# EAGLE design optoinout_breakout (EAGLE 9.4.0)
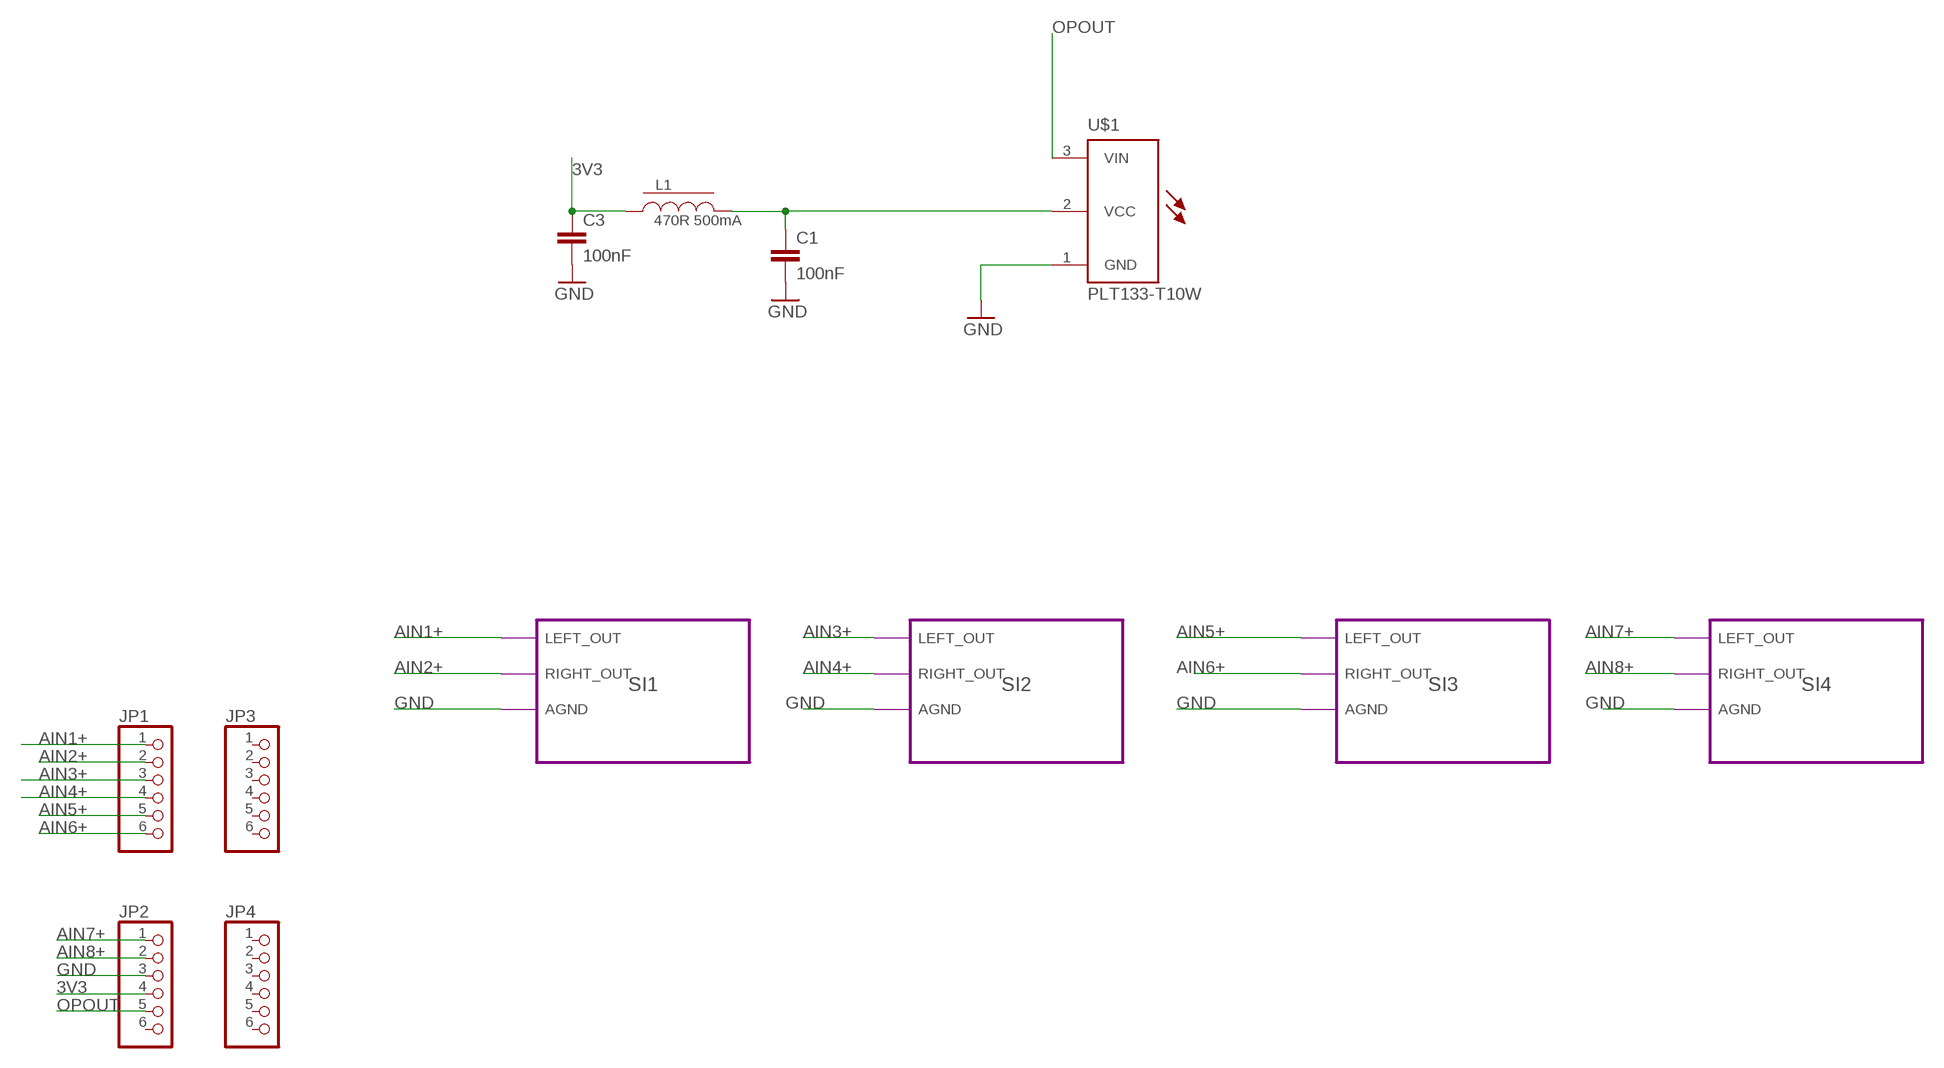
[diagram p0: schematic, sheet 1]

## Parts
C1  100nF  C-EUC1206  [C1206]
C3  100nF  C-EUC1206  [C1206]
JP1  PINHD-1X6  [1X06]
JP2  PINHD-1X6  [1X06]
JP3  PINHD-1X6  [1X06]
JP4  PINHD-1X6  [1X06]
L1  470R 500mA  EXC3BPL0805  [L0805]
U$1  PLT133-T10W  [PLR135-T10_PLT133-T10W]

## Module instances
SI1 = STIN
SI2 = STIN
SI3 = STIN
SI4 = STIN

## Nets
3V3: C3.1 JP2.4 L1.P$1
AIN1+: JP1.1 ; port SI1.LEFT_OUT
AIN2+: JP1.2 ; port SI1.RIGHT_OUT
AIN3+: JP1.3 ; port SI2.LEFT_OUT
AIN4+: JP1.4 ; port SI2.RIGHT_OUT
AIN5+: JP1.5 ; port SI3.LEFT_OUT
AIN6+: JP1.6 ; port SI3.RIGHT_OUT
AIN7+: JP2.1 ; port SI4.LEFT_OUT
AIN8+: JP2.2 ; port SI4.RIGHT_OUT
GND: C1.2 C3.2 JP2.3 U$1.1(GND) ; port SI1.AGND SI2.AGND SI3.AGND SI4.AGND
N$3: C1.1 L1.P$2 U$1.2(VCC)
OPOUT: JP2.5 U$1.3(VIN)
Unconnected: JP2.6 JP3.1 JP3.2 JP3.3 JP3.4 JP3.5 JP3.6 JP4.1 JP4.2 JP4.3 JP4.4 JP4.5 JP4.6

## Library data of the parts
C1 C3 = resistor:C-EU: CAPACITOR, European symbol
JP1-JP4 = pinhead:PINHD-1X6: PIN HEADER
L1 = ferrite:EXC3BP: Chip Bead Core
U$1 = PLT133-T10W:PLT133-T10W: Photo-link Light Transmitter Unit; AVAILABILITY: Unavailable; DESCRIPTION: PLT133 Series 2.7 - 5.5 V 16 Mbps 5.5 mA 680 nm Photo-Link Light Transmitter; MF: Everlight Electronics; MP: PLT133/T10W; PACKAGE: DIP-5 Everlight; PRICE: None

## Module STIN
Ports: LEFT_OUT(io) RIGHT_OUT(io) AGND(io)
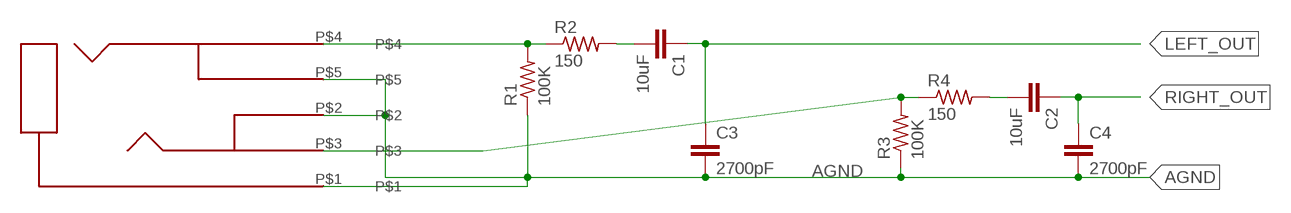
[diagram p1: schematic, module STIN, sheet 1]

### Parts
C1  10uF  C-EUC1206  [C1206]
C2  10uF  C-EUC1206  [C1206]
C3  2700pF  C-EUC1206  [C1206]
C4  2700pF  C-EUC1206  [C1206]
R1  100K  R-US_R1206  [R1206]
R2  150  R-US_R1206  [R1206]
R3  100K  R-US_R1206  [R1206]
R4  150  R-US_R1206  [R1206]
U$3  ACJS-MV-5  [ACJS-MV5]

### Nets
AGND: C3.2 C4.2 R1.1 R3.1 U$3.P$1 U$3.P$2 U$3.P$5
LEFT_OUT [defaultyyyy]: C1.1 C3.1
N$1 [defaultyyyy]: R1.2 R2.1 U$3.P$4
N$7 [defaultyyyy]: C1.2 R2.2
N$10 [defaultyyyy]: R3.2 R4.1 U$3.P$3
N$11 [defaultyyyy]: C2.2 R4.2
RIGHT_OUT [defaultyyyy]: C2.1 C4.1

### Library data of the parts
C1-C4 = resistor-nick:C-EU: CAPACITOR, European symbol
R1-R4 = resistor-nick:R-US_: RESISTOR, American symbol
U$3 = acjs-mv:ACJS-MV-5

## Net classes
0 default: width 0.356 mm
1 defaultyyyy: width 0.356 mm

## Board
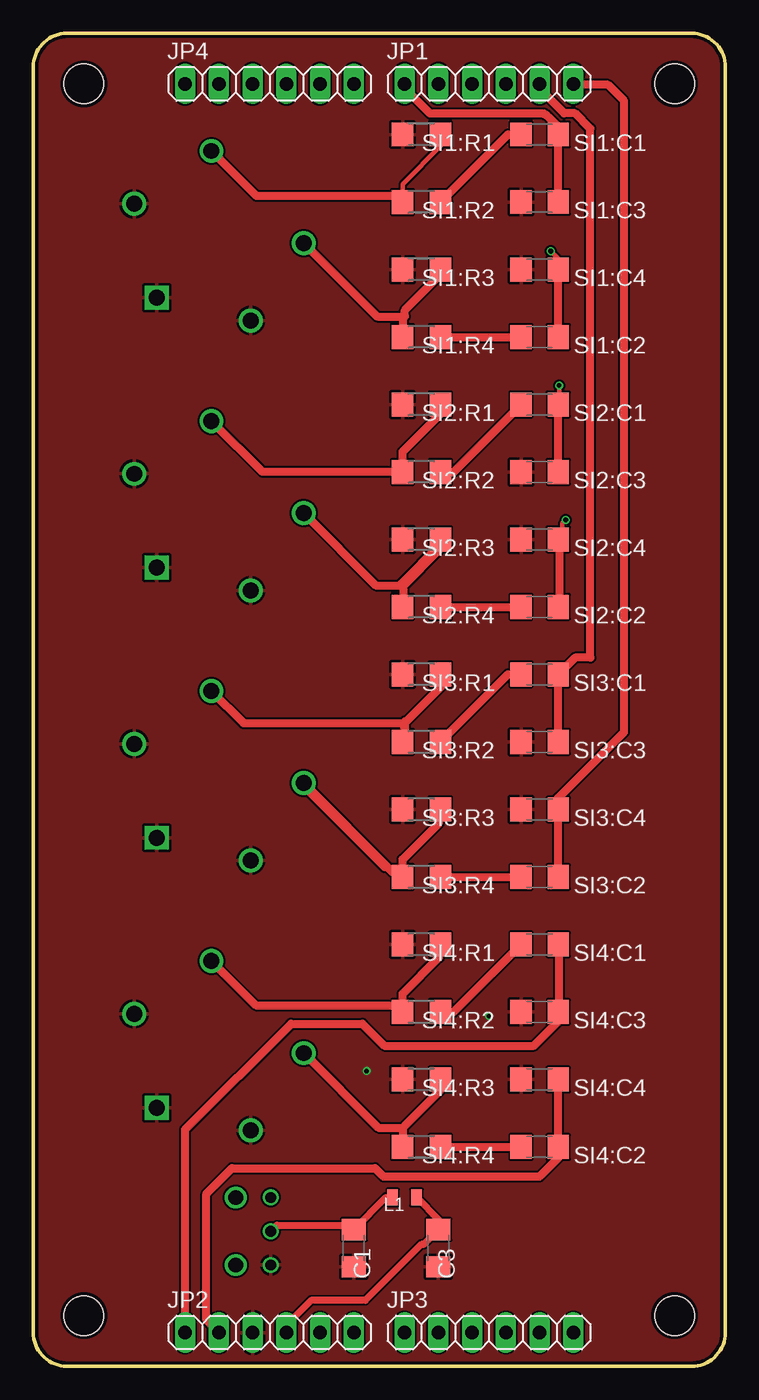
[diagram p2: board, top side]
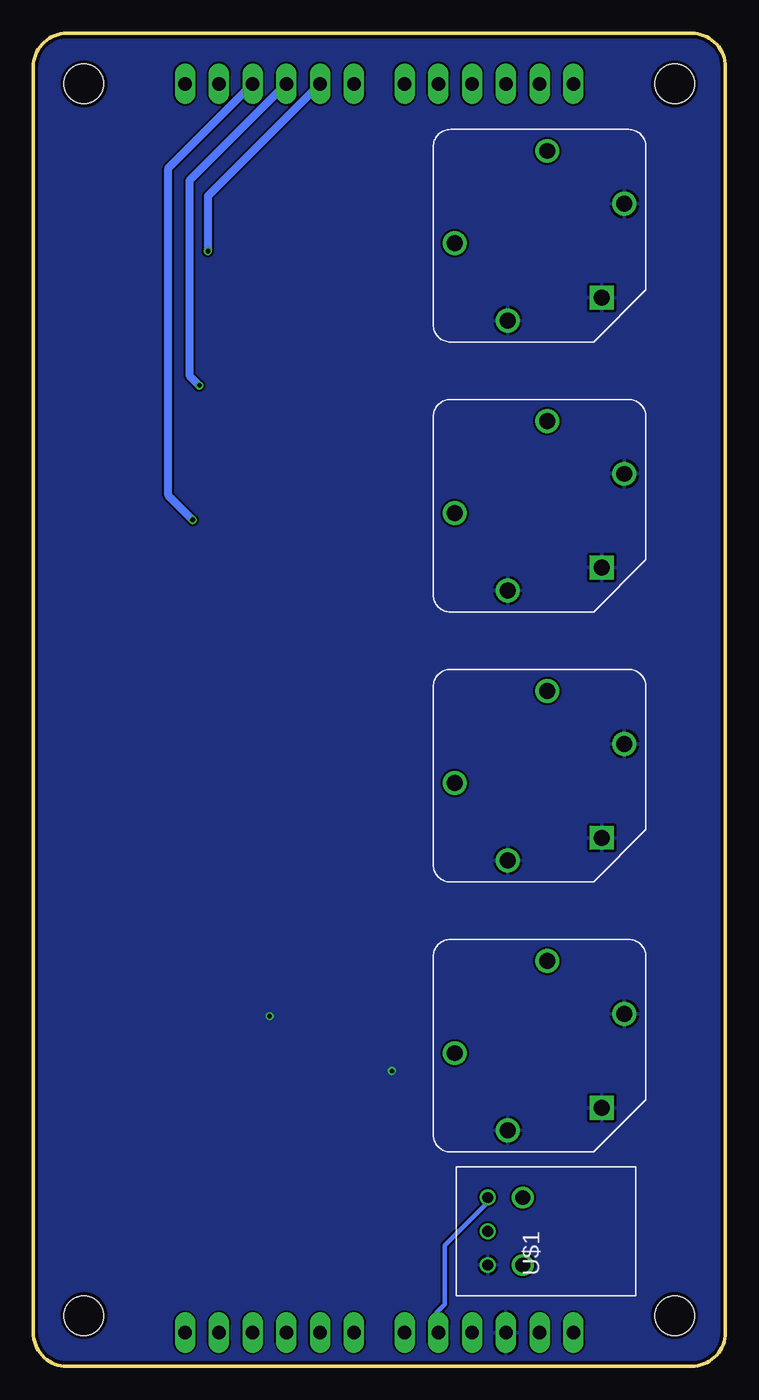
[diagram p3: board, bottom side, seen from below]

Size 52.07 x 100.33 mm. Coordinates in mm from the lower left corner, seen from the top.
Outline: 0,97.79 0,2.54 arc90 2.54,0 49.53,0 arc90 52.07,2.52 52.07,97.79 arc90 49.53,100.33 2.54,100.33 arc90 0,97.79
Copper layers (1*16): Top 0.018mm / dielectric 1.55mm / Bottom 0.018mm
Design rules "eC_2Layer_PClass6_BaseCopperO18_eCDefault": minimum track width 0.15mm, minimum drill 0.35mm, track to track 0.15mm, track to pad 0.15mm, pad to pad 0.15mm, via to via 0.15mm, smd to smd 0mil, copper to edge 0.25mm, drill to drill 0.35mm, minimum pad ring 0.175mm, minimum via ring 0.125mm, stop-mask expansion 0mil, vias tented up to drill 0.45mm, thermal gap 0.2mm
Holes 3 mm at 3.81,96.52 48.26,96.52 3.81,3.81 48.26,3.81

### Footprints (pad centres in the part's own frame; a part is rotated, then mirrored left to right if it is on the bottom)
C1206 = smd 1.6 x 1.8: 1 -1.4,0; 2 1.4,0
1X06 = drill 1.016 long: 1 -6.35,0; 2 -3.81,0; 3 -1.27,0; 4 1.27,0; 5 3.81,0; 6 6.35,0
L0805 = smd 0.8 x 1.2: P$1 -0.9,0; P$2 0.9,0
R1206 = smd 1.6 x 1.803: 1 -1.422,0; 2 1.422,0
ACJS-MV5 = drill 1.2 square: P$1 4.67,-4.67 | drill 1.2: P$2 -2.4,-6.38; P$3 -6.38,-0.56; P$4 0.56,6.38; P$5 6.38,2.4
PLR135-T10_PLT133-T10W = drill 0.8: 1 2.54,-2.63; 2 0,-2.63; 3 -2.54,-2.63 | drill 1.1: NC1 2.54,0; NC2 -2.54,0

### Placement (x,y rotation side)
C1  24.13,8.89 270 top
C3  30.48,8.89 270 top
JP1  34.29,96.52 0 top
JP2  17.78,2.54 0 top
JP3  34.29,2.54 0 top
JP4  17.78,96.52 0 top
L1  27.94,12.7 180 top
SI1:C1  10uF  [C1206]  38.1,92.71 180 top
SI1:C2  10uF  [C1206]  38.1,77.47 180 top
SI1:C3  2700pF  [C1206]  38.1,87.63 180 top
SI1:C4  2700pF  [C1206]  38.1,82.55 180 top
SI1:R1  100K  [R1206]  29.21,92.71 0 top
SI1:R2  150  [R1206]  29.21,87.63 0 top
SI1:R3  100K  [R1206]  29.21,82.55 0 top
SI1:R4  150  [R1206]  29.21,77.47 0 top
SI1:U$3  ACJS-MV-5  [ACJS-MV5]  13.97,85.09 0 bottom
SI2:C1  10uF  [C1206]  38.1,72.39 180 top
SI2:C2  10uF  [C1206]  38.1,57.15 180 top
SI2:C3  2700pF  [C1206]  38.1,67.31 180 top
SI2:C4  2700pF  [C1206]  38.1,62.23 180 top
SI2:R1  100K  [R1206]  29.21,72.39 0 top
SI2:R2  150  [R1206]  29.21,67.31 0 top
SI2:R3  100K  [R1206]  29.21,62.23 0 top
SI2:R4  150  [R1206]  29.21,57.15 0 top
SI2:U$3  ACJS-MV-5  [ACJS-MV5]  13.97,64.77 0 bottom
SI3:C1  10uF  [C1206]  38.1,52.07 180 top
SI3:C2  10uF  [C1206]  38.1,36.83 180 top
SI3:C3  2700pF  [C1206]  38.1,46.99 180 top
SI3:C4  2700pF  [C1206]  38.1,41.91 180 top
SI3:R1  100K  [R1206]  29.21,52.07 0 top
SI3:R2  150  [R1206]  29.21,46.99 0 top
SI3:R3  100K  [R1206]  29.21,41.91 0 top
SI3:R4  150  [R1206]  29.21,36.83 0 top
SI3:U$3  ACJS-MV-5  [ACJS-MV5]  13.97,44.45 0 bottom
SI4:C1  10uF  [C1206]  38.1,31.75 180 top
SI4:C2  10uF  [C1206]  38.1,16.51 180 top
SI4:C3  2700pF  [C1206]  38.1,26.67 180 top
SI4:C4  2700pF  [C1206]  38.1,21.59 180 top
SI4:R1  100K  [R1206]  29.21,31.75 0 top
SI4:R2  150  [R1206]  29.21,26.67 0 top
SI4:R3  100K  [R1206]  29.21,21.59 0 top
SI4:R4  150  [R1206]  29.21,16.51 0 top
SI4:U$3  ACJS-MV-5  [ACJS-MV5]  13.97,24.13 0 bottom
U$1  15.24,10.16 270 bottom

### Tracks (layer width: path | path; a pad name or v marks a point on that pad's centre or on a via)
3V3
  Top 0.508: L1.P$1 30.48,11.06 C3.1 29.37,9.18 29.21,9.18 24.99,4.95 20.91,4.95 19.13,3.17 19.09,3.17 19.05,3.14 JP2.4
AIN1+
  Top 0.356: 39.56,92.39 39.56,92.65 SI1:C1.1 | 38.42,94.29 38.49,94.29 38.61,94.17 38.77,94.01
  Top 0.61: SI1:C3.1 39.5,92.33 39.56,92.39 | JP1.1 27.94,96.2 29.85,94.29 38.42,94.29 38.54,94.17 38.61,94.17 | 38.77,94.01 39.5,93.28 SI1:C1.1
AIN2+  (via drill 0.35)
  Top 0.356: 39.56,82.54 SI1:C4.1 39.56,82.67 39.56,83.3 v38.93,83.93
  Top 0.61: SI1:C2.1 39.5,82.48 39.56,82.54
  Bottom 0.61: JP1.2 38.93,88.07 v38.93,83.93
AIN3+  (via drill 0.35)
  Top 0.356: 39.56,72.3 SI2:C1.1 39.56,72.55 v39.56,73.82
  Top 0.61: SI2:C3.1 39.5,72.24 39.56,72.3
  Bottom 0.61: JP1.3 40.32,89.22 40.32,74.58 v39.56,73.82
AIN4+  (via drill 0.35)
  Top 0.356: 39.56,57.26 SI2:C2.1 | v40.07,63.71 39.82,63.45 39.82,62.44 39.69,62.31 SI2:C4.1
  Top 0.61: SI2:C4.1 39.56,62.17 39.56,57.26
  Bottom 0.356: 35.65,96.44 JP1.4
  Bottom 0.61: v40.07,63.71 41.91,65.55 41.91,90.18 35.65,96.44
AIN5+
  Top 0.356: SI3:C3.1 39.56,47.02 39.56,51.95 SI3:C1.1 39.48,52.12 39.44,52.2 39.44,52.84 | 39.94,94.29 40.57,94.29 40.95,93.92
  Top 0.61: SI3:C3.1 39.5,52.1 39.48,52.12 | SI3:C1.1 40.77,53.34 41.91,53.34 41.91,93.15 40.77,94.29 39.94,94.29 38.1,96.14 JP1.5
AIN6+
  Top 0.356: SI3:C2.1 39.56,36.91 39.56,41.84 SI3:C4.1 39.44,42.09 39.44,42.72 41.46,44.75 | 40.7,96.44 JP1.6
  Top 0.61: SI3:C2.1 39.5,42.09 39.44,42.09 | SI3:C4.1 39.5,42.79 41.46,44.75 44.45,47.74 44.45,95.25 43.26,96.44 40.7,96.44
AIN7+
  Top 0.356: 39.56,31.73 SI4:C1.1 | 38.68,25.03 39.56,25.91 39.56,26.04 39.56,26.54 SI4:C3.1
  Top 0.61: SI4:C3.1 39.56,26.73 39.56,31.73 | JP2.1 11.43,17.82 19.4,25.79 24.77,25.79 26.42,24.13 37.66,24.13 39.56,26.04
AIN8+
  Top 0.356: 39.56,21.49 SI4:C4.1 | 39.56,16.43 SI4:C2.1
  Top 0.61: SI4:C2.1 39.5,21.43 39.56,21.49 | JP2.2 13.02,3.49 13.02,12.98 14.95,14.91 25.73,14.91 26.35,14.29 38.1,14.29 39.56,15.75 39.56,16.43
GND  (via drill 0.35)
  other vias: 34.29,26.35 25.08,22.23
  pour Top: -1.27,101.6 54.61,101.6 54.61,-1.27 -1.27,-1.27
  pour Bottom: 0,100.33 52.07,100.33 52.07,0 0,0
N$3
  Top 0.356: 24.02,10.62 C1.1
  Top 0.508: U$1.2 18.33,10.62 24.02,10.62 | C1.1 26.54,12.7 L1.P$2
OPOUT
  Bottom 0.356: U$1.3 17.95,12.64 17.95,12.26 21.11,9.1 21.11,4.68 21.74,4.04 21.61,3.92 21.61,2.65 JP2.5
SI1:N$1
  Top 0.356: SI1:R1.2 30.71,92.65 30.71,91.89 27.81,88.99 27.81,87.72 SI1:R2.1 27.68,88.1 27.62,88.1
  Top 0.61: SI1:U$3.P$4 16.78,88.1 27.62,88.1
SI1:N$7
  Top 0.356: 36.02,92.65 36.66,92.65 SI1:C1.2 | 30.71,87.72 31.11,87.72
  Top 0.61: SI1:R2.2 30.71,87.72 30.71,87.71 SI1:R2.2 | SI1:R2.2 31.02,87.63 31.11,87.72 | SI1:R2.2 30.13,87.63 | SI1:R2.2 30.8,87.63 | SI1:R2.2 31,87.63 | SI1:R2.2 31.17,87.63 | SI1:R2.2 35.71,92.71 SI1:C1.2 36.08,92.71 36.02,92.65
SI1:N$10
  Top 0.356: 27.81,78.87 27.81,78.74 | 27.81,78.87 27.97,79.03 | 30.71,82.23 30.71,82.54 SI1:R3.2 | 27.81,79 27.81,78.87
  Top 0.61: SI1:U$3.P$3 25.88,79 27.81,79 | 27.97,79.03 27.97,79.48 30.71,82.23 | 27.81,78.74 27.81,77.49 SI1:R4.1
SI1:N$11
  Top 0.61: SI1:R4.2 SI1:C2.2
SI2:N$1
  Top 0.356: 30.71,71.75 30.71,72.3 SI2:R1.2 | 13.53,71.04 SI2:U$3.P$4
  Top 0.61: 30.71,71.75 27.79,68.83 SI2:R2.1 17.25,67.31 13.53,71.04
SI2:N$7
  Top 0.61: SI2:R2.2 31.62,67.31 SI2:C1.2
SI2:N$10
  Top 0.356: 27.81,58.52 27.81,57.26 SI2:R4.1 | 27.81,58.52 27.82,58.54 30.71,61.43 30.71,61.91 30.71,62.19 SI2:R3.2 | 27.68,58.78 27.81,58.65 27.81,58.52
  Top 0.61: SI2:U$3.P$3 25.78,58.78 27.68,58.78 27.68,58.88 30.71,61.91 | 27.82,58.54 27.82,57.18 SI2:R4.1
SI2:N$11
  Top 0.61: SI2:R4.2 SI2:C2.2
SI3:N$1
  Top 0.356: SI3:R2.1 27.81,47.02 27.81,48.26 27.81,48.41 27.96,48.56 30.71,51.32 30.71,51.75 30.71,51.95 SI3:R1.2
  Top 0.61: SI3:U$3.P$4 15.83,48.41 27.81,48.41 | 27.96,48.56 27.96,47.16 SI3:R2.1 | 27.81,48.26 30.71,51.17 30.71,51.75
SI3:N$7
  Top 0.61: SI3:R2.2 35.71,52.07 SI3:C1.2
SI3:N$10
  Top 0.356: 30.54,40.9 30.71,41.08 30.71,41.84 SI3:R3.2 | SI3:U$3.P$3 20.35,43.86 20.35,43.48 26.42,37.41 27.68,37.41 SI3:R4.1
  Top 0.61: SI3:R4.1 27.79,37.15 | 27.79,37.15 27.79,38.15 30.54,40.9 | SI3:U$3.P$3 27.09,37.15 27.79,37.15
SI3:N$11
  Top 0.356: 36.66,36.91 SI3:C2.2
  Top 0.61: SI3:R4.2 36.58,36.83 36.66,36.91
SI4:N$1
  Top 0.356: 30.51,30.77 30.71,30.97 30.71,31.73 SI4:R1.2 | 27.62,27.18 27.68,27.18 SI4:R2.1
  Top 0.61: SI4:R2.1 27.79,28.04 30.51,30.77 | SI4:U$3.P$4 16.74,27.18 27.62,27.18
SI4:N$7
  Top 0.61: SI4:R2.2 31.62,26.67 SI4:C1.2
SI4:N$10
  Top 0.356: 30.65,20.79 30.71,20.86 30.71,21.49 SI4:R3.2 | 27.81,17.95 27.95,18.09
  Top 0.61: SI4:U$3.P$3 25.97,17.95 27.81,17.95 27.81,16.53 SI4:R4.1 | 27.95,18.09 30.65,20.79
SI4:N$11
  Top 0.356: 36.66,16.56 SI4:C2.2
  Top 0.61: SI4:R4.2 36.61,16.51 36.66,16.56

### Text on the board
tDocu: Moolet Modular | ADAT / version 1.0
bDocu: nicnewdigate@gmail.com